# EAGLE design ntp-strat2 (EAGLE 7.6.0)
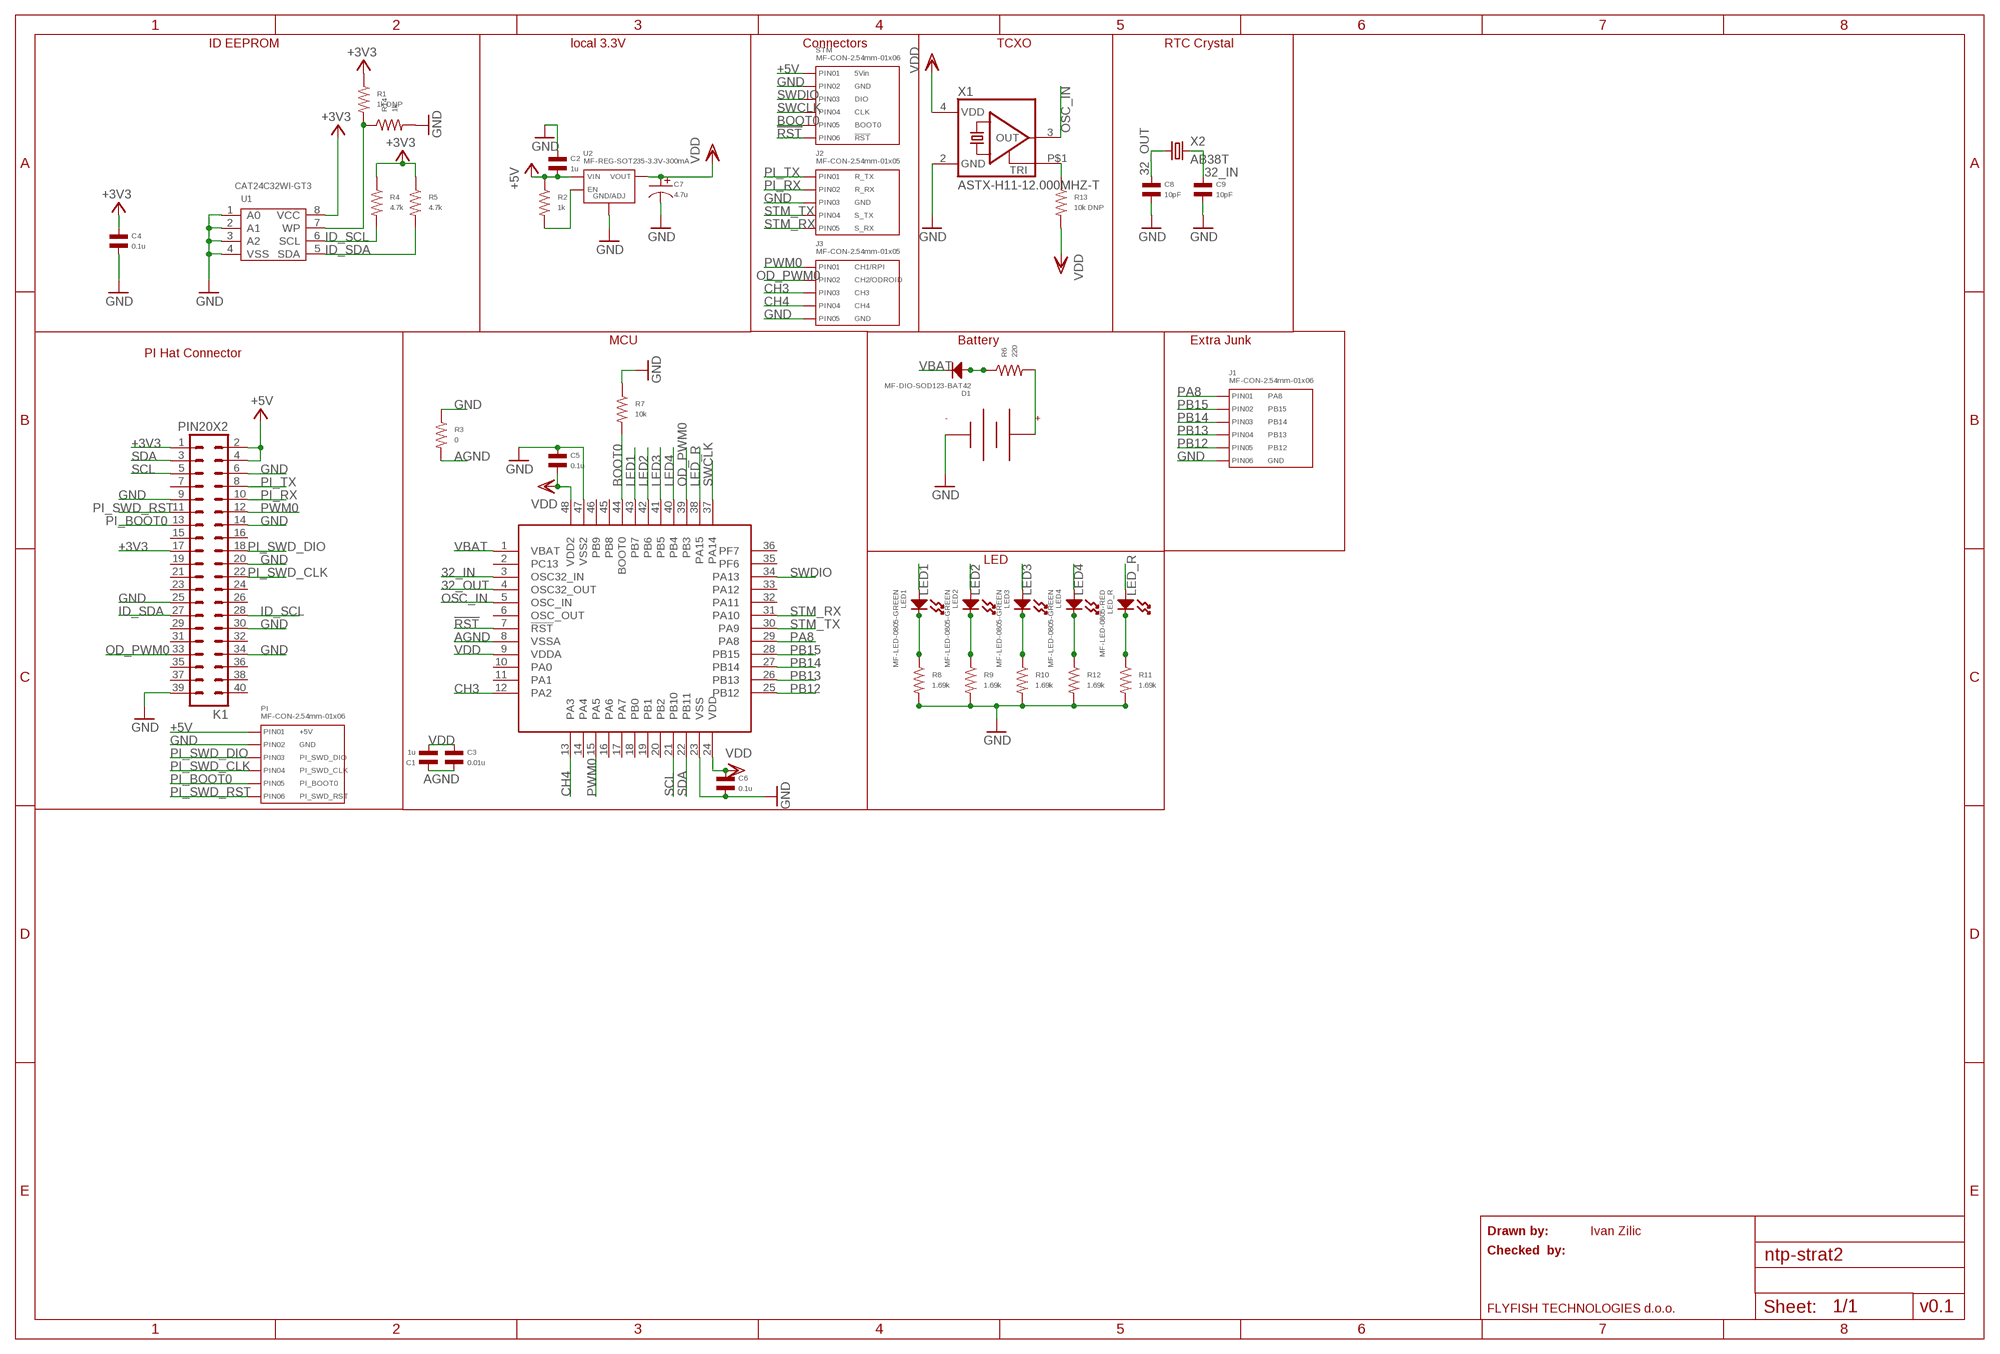
[diagram p0: schematic, sheet 1]

## Parts
C1  1u  CAPACITOR_NP_0603  [C0603]
C2  1u  CAPACITOR_NP_0603  [C0603]
C3  0.01u  CAPACITOR_NP_0603  [C0603]
C4  0.1u  CAPACITOR_NP_0603  [C0603]
C5  0.1u  CAPACITOR_NP_0603  [C0603]
C6  0.1u  CAPACITOR_NP_0603  [C0603]
C7  4.7u  CAPACITOR_P_4MM  [CP4MM]
C8  10pF  CAPACITOR_NP_0603  [C0603]
C9  10pF  CAPACITOR_NP_0603  [C0603]
D1  MF-DIO-SOD123-BAT42  DIODES_BAT42_SOD-123  [SOD-123]
J1  MF-CON-2.54mm-01x06  CON_01X06_PTH_2.54MM  [PTH_2.54MM_01X06]
J2  MF-CON-2.54mm-01x05  CON_01X05_PTH_2.54MM  [PTH_2.54MM_01X05]
J3  MF-CON-2.54mm-01x05  CON_01X05_PTH_2.54MM  [PTH_2.54MM_01X05]
K1  PIN20X2  [PIN_20X2]
LED1  MF-LED-0805-GREEN  LED_SINGLE-0805-GREEN  [LED0805]
LED2  MF-LED-0805-GREEN  LED_SINGLE-0805-GREEN  [LED0805]
LED3  MF-LED-0805-GREEN  LED_SINGLE-0805-GREEN  [LED0805]
LED4  MF-LED-0805-GREEN  LED_SINGLE-0805-GREEN  [LED0805]
LED_R  MF-LED-0805-RED  LED_SINGLE-0805-RED  [LED0805]
PI  MF-CON-2.54mm-01x06  CON_01X06_PTH_2.54MM  [PTH_2.54MM_01X06]
R1  1k DNP  RESISTOR_0603  [R0603]
R2  1k  RESISTOR_0603  [R0603]
R3  0  RESISTOR_0603  [R0603]
R4  4.7k  RESISTOR_0603  [R0603]
R5  4.7k  RESISTOR_0603  [R0603]
R6  220  RESISTOR_0603  [R0603]
R7  10k  RESISTOR_0603  [R0603]
R8  1.69k  RESISTOR_0603  [R0603]
R9  1.69k  RESISTOR_0603  [R0603]
R10  1.69k  RESISTOR_0603  [R0603]
R11  1.69k  RESISTOR_0603  [R0603]
R12  1.69k  RESISTOR_0603  [R0603]
R13  10k DNP  RESISTOR_0603  [R0603]
R14  1k  RESISTOR_0603  [R0603]
STM  MF-CON-2.54mm-01x06  CON_01X06_PTH_2.54MM  [PTH_2.54MM_01X06]
U1  CAT24C32WI-GT3  EEPROM-CAT24C256WI-GT3(SOIC8)  [SOIC8-1.27-5X4MM]
U2  MF-REG-SOT235-3.3V-300mA  TLV70233PDBVR  [SOT-23-5]
U3  STM32F031C6T6  STM32F031C  [LQFP48-7X7]
U4  BU2032SM-BT-GTR  BU2032SM  [BU2032SM]
X1  ASTX-H11-12.000MHZ-T  ASTX-H11  [ASVTX]
X2  AB38T  [AB38T]

## Nets
32_IN: C9.P$1 U3.3(OSC32_IN) X2.P2
32_OUT: C8.P$1 U3.4(OSC32_OUT) X2.P1
!RST: STM.P$6(PIN6) U3.7(!RST)
+3V3: C4.P$1 K1.1 K1.17 R1.P$1 R4.P$1 R5.P$1 U1.8(VCC)
+5V: C2.P$2 K1.2 K1.4 PI.P$1(PIN1) R2.P$1 STM.P$1(PIN1) U2.P$1(VIN)
AGND: C1.P$1 C3.P$2 R3.P$2 U3.8(VSSA)
BOOT0: R7.P$2 STM.P$5(PIN5) U3.44(BOOT0)
CH3: J3.P$3(PIN3) U3.12(PA2)
CH4: J3.P$4(PIN4) U3.13(PA3)
GND: C2.P$1 C4.P$2 C5.P$1 C6.P$2 C7.P$2 C8.P$2 C9.P$2 J1.P$6(PIN6) J2.P$3(PIN3) J3.P$5(PIN5) K1.6 K1.9 K1.14 K1.20 K1.25 K1.30 K1.34 K1.39 PI.P$2(PIN2) R3.P$1 R7.P$1 R8.P$2 R9.P$2 R10.P$2 R11.P$2 R12.P$2 R14.P$2 STM.P$2(PIN2) U1.1(A0) U1.2(A1) U1.3(A2) U1.4(VSS) U2.P$2(GND/ADJ) U3.23(VSS) U3.47(VSS2) U4.MINUS X1.2(GND)
ID_SCL: K1.28 R4.P$2 U1.6(SCL)
ID_SDA: K1.27 R5.P$2 U1.5(SDA)
LED1: LED1.ANODE U3.43(PB7)
LED2: LED2.ANODE U3.42(PB6)
LED3: LED3.ANODE U3.41(PB5)
LED4: LED4.ANODE U3.40(PB4)
LED_R: LED_R.ANODE U3.38(PA15)
N$1: R2.P$2 U2.P$3(EN)
N$2: LED1.CATHODE R8.P$1
N$3: R1.P$2 R14.P$1 U1.7(WP)
N$4: D1.ANODE R6.P$1
N$5: LED2.CATHODE R9.P$1
N$6: LED3.CATHODE R10.P$1
N$7: LED_R.CATHODE R11.P$1
N$8: LED4.CATHODE R12.P$1
N$9: R6.P$2 U4.PLUS
N$10: R13.P$1 X1.P$1(TRI)
OD_PWM0: J3.P$2(PIN2) K1.33 U3.39(PB3)
OSC_IN: U3.5(OSC_IN) X1.3(OUT)
PA8: J1.P$1(PIN1) U3.29(PA8)
PB12: J1.P$5(PIN5) U3.25(PB12)
PB13: J1.P$4(PIN4) U3.26(PB13)
PB14: J1.P$3(PIN3) U3.27(PB14)
PB15: J1.P$2(PIN2) U3.28(PB15)
PI_BOOT0: K1.13 PI.P$5(PIN5)
PI_RX: J2.P$2(PIN2) K1.10
PI_SWD_CLK: K1.22 PI.P$4(PIN4)
PI_SWD_DIO: K1.18 PI.P$3(PIN3)
PI_SWD_RST: K1.11 PI.P$6(PIN6)
PI_TX: J2.P$1(PIN1) K1.8
PWM0: J3.P$1(PIN1) K1.12 U3.15(PA5)
SCL: K1.5 U3.21(PB10)
SDA: K1.3 U3.22(PB11)
STM_RX: J2.P$5(PIN5) U3.31(PA10)
STM_TX: J2.P$4(PIN4) U3.30(PA9)
SWCLK: STM.P$4(PIN4) U3.37(PA14)
SWDIO: STM.P$3(PIN3) U3.34(PA13)
VBAT: D1.CATHODE U3.1(VBAT)
VDD: C1.P$2 C3.P$1 C5.P$2 C6.P$1 C7.P$1 R13.P$2 U2.P$5(VOUT) U3.9(VDDA) U3.24(VDD) U3.48(VDD2) X1.4(VDD)
Unconnected: K1.7 K1.15 K1.16 K1.19 K1.21 K1.23 K1.24 K1.26 K1.29 K1.31 K1.32 K1.35 K1.36 K1.37 K1.38 K1.40 U3.2(PC13) U3.6(OSC_OUT) U3.10(PA0) U3.11(PA1) U3.14(PA4) U3.16(PA6) U3.17(PA7) U3.18(PB0) U3.19(PB1) U3.20(PB2) U3.32(PA11) U3.33(PA12) U3.35(PF6) U3.36(PF7) U3.45(PB8) U3.46(PB9)

## Notes on the sheet
- ID EEPROM | local 3.3V | Connectors | TCXO | RTC Crystal
- MCU | Battery | Extra Junk
- PI Hat Connector
- LED
- Drawn by: | Ivan Zilic
- Checked  by:
- FLYFISH TECHNOLOGIES d.o.o. | v0.1

## Library data of the parts
C1-C6 C8 C9 = MF_Passives:CAPACITOR_NP: Library: MF_Passives Description: Device for Non-Polarized Capacitors. Manufacture part number (MPN) can be added via Attributes. Check https://factory.macrofab.com/parts for the house parts list.; POPULATE: 1
C7 = MF_Passives:CAPACITOR_P: Library: MF_Passives Description: Device for Polarized Capacitors. Manufacture part number (MPN), Voltage Rating, and Tolerance can be added via Attributes. Check https://factory.macrofab.com/parts for the house parts list.; HOUSEPART: MF-CAP-4MM-4.7uF; POPULATE: 1
D1 = MF_Discrete_Semiconductor:DIODES: Library: MF_Discrete_Semiconductor Description: Device for Single Packaged Diodes.; HOUSEPART: YES; MPN: MF-DIO-SOD123-BAT42; POPULATE: 1; URL: https://factory.macrofab.com/part/MF-DIO-SOD123-BAT42
J1 = MF_Connectors:CON_01X06: Library: MF_Connectors Description: Header Connector with 6 Positions and 01 Rows. Use the LABEL Attribute to label the pin on the schematic and PCB. You can remove the attributes on the PCB by using the SMASH function on the part and then deleting the text.; HOUSEPART: YES; LABEL01: PA8; LABEL02: PB15; LABEL03: PB14; LABEL04: PB13; LABEL05: PB12; LABEL06: GND; MPN: MF-CON-2.54mm-01x06; POPULATE: 1; URL: https://factory.macrofab.com/part/MF-CON-2.54mm-01x06
J2 = MF_Connectors:CON_01X05: Library: MF_Connectors Description: Header Connector with 5 Positions and 01 Rows. Use the LABEL Attribute to label the pin on the schematic and PCB. You can remove the attributes on the PCB by using the SMASH function on the part and then deleting the text.; HOUSEPART: YES; LABEL01: R_TX; LABEL02: R_RX; LABEL03: GND; LABEL04: S_TX; LABEL05: S_RX; MPN: MF-CON-2.54mm-01x05; POPULATE: 1; URL: https://factory.macrofab.com/part/MF-CON-2.54mm-01x05
J3 = MF_Connectors:CON_01X05: Library: MF_Connectors Description: Header Connector with 5 Positions and 01 Rows. Use the LABEL Attribute to label the pin on the schematic and PCB. You can remove the attributes on the PCB by using the SMASH function on the part and then deleting the text.; HOUSEPART: YES; LABEL01: CH1/RPI; LABEL02: CH2/ODROID; LABEL03: CH3; LABEL04: CH4; LABEL05: GND; MPN: MF-CON-2.54mm-01x05; POPULATE: 1; URL: https://factory.macrofab.com/part/MF-CON-2.54mm-01x05
K1 = FLYFISH:PIN20X2
LED1-LED4 = MF_LEDs:LED_SINGLE: Library: MF_LEDs Description: Device for Single LED Packages. Manufacture part number (MFG#) can be added via Attributes.; HOUSEPART: YES; MPN: MF-LED-0805-GREEN; POPULATE: 1; URL: https://factory.macrofab.com/part/MF-LED-0805-GREEN
LED_R = MF_LEDs:LED_SINGLE: Library: MF_LEDs Description: Device for Single LED Packages. Manufacture part number (MFG#) can be added via Attributes.; HOUSEPART: YES; MPN: MF-LED-0805-RED; POPULATE: 1; URL: https://factory.macrofab.com/part/MF-LED-0805-RED
PI = MF_Connectors:CON_01X06: Library: MF_Connectors Description: Header Connector with 6 Positions and 01 Rows. Use the LABEL Attribute to label the pin on the schematic and PCB. You can remove the attributes on the PCB by using the SMASH function on the part and then deleting the text.; HOUSEPART: YES; LABEL01: +5V; LABEL02: GND; LABEL03: PI_SWD_DIO; LABEL04: PI_SWD_CLK; LABEL05: PI_BOOT0; LABEL06: PI_SWD_RST; MPN: MF-CON-2.54mm-01x06; POPULATE: 1; URL: https://factory.macrofab.com/part/MF-CON-2.54mm-01x06
R1-R14 = MF_Passives:RESISTOR: Library: MF_Passives Description: Device for Resistors. Manufacture part number (MPN), Voltage, Tolerance, and Wattage Rating can be added via Attributes. Check https://factory.macrofab.com/parts for the house parts list.; POPULATE: 1
STM = MF_Connectors:CON_01X06: Library: MF_Connectors Description: Header Connector with 6 Positions and 01 Rows. Use the LABEL Attribute to label the pin on the schematic and PCB. You can remove the attributes on the PCB by using the SMASH function on the part and then deleting the text.; HOUSEPART: YES; LABEL01: 5Vin; LABEL02: GND; LABEL03: DIO; LABEL04: CLK; LABEL05: BOOT0; LABEL06: !RST; MPN: MF-CON-2.54mm-01x06; POPULATE: 1; URL: https://factory.macrofab.com/part/MF-CON-2.54mm-01x06
U1 = Seeed-OPL-ic:EEPROM-CAT24C256WI-GT3(SOIC8): 310090035; MPN: CAT24C256WI-GT3; VALUE: CAT24C256WI-GT3-SOIC8
U2 = MF_IC_Power:TLV702: Manufacturer Part #: TLV702 Manufacturer: Texas Instruments Description: LDO Voltage Regulators; HOUSEPART: YES; MPN: F-REG-SOT235-3.3V-300mA; POPULATE: 1; URL: https://factory.macrofab.com/part/MF-REG-SOT235-3.3V-300mA; VALUE: F-REG-SOT235-3.3V-300mA
U3 = STM32:STM32F031C
U4 = STM32:BU2032SM
X1 = crystal:ASTX-H11
X2 = crystal:AB38T

## Board
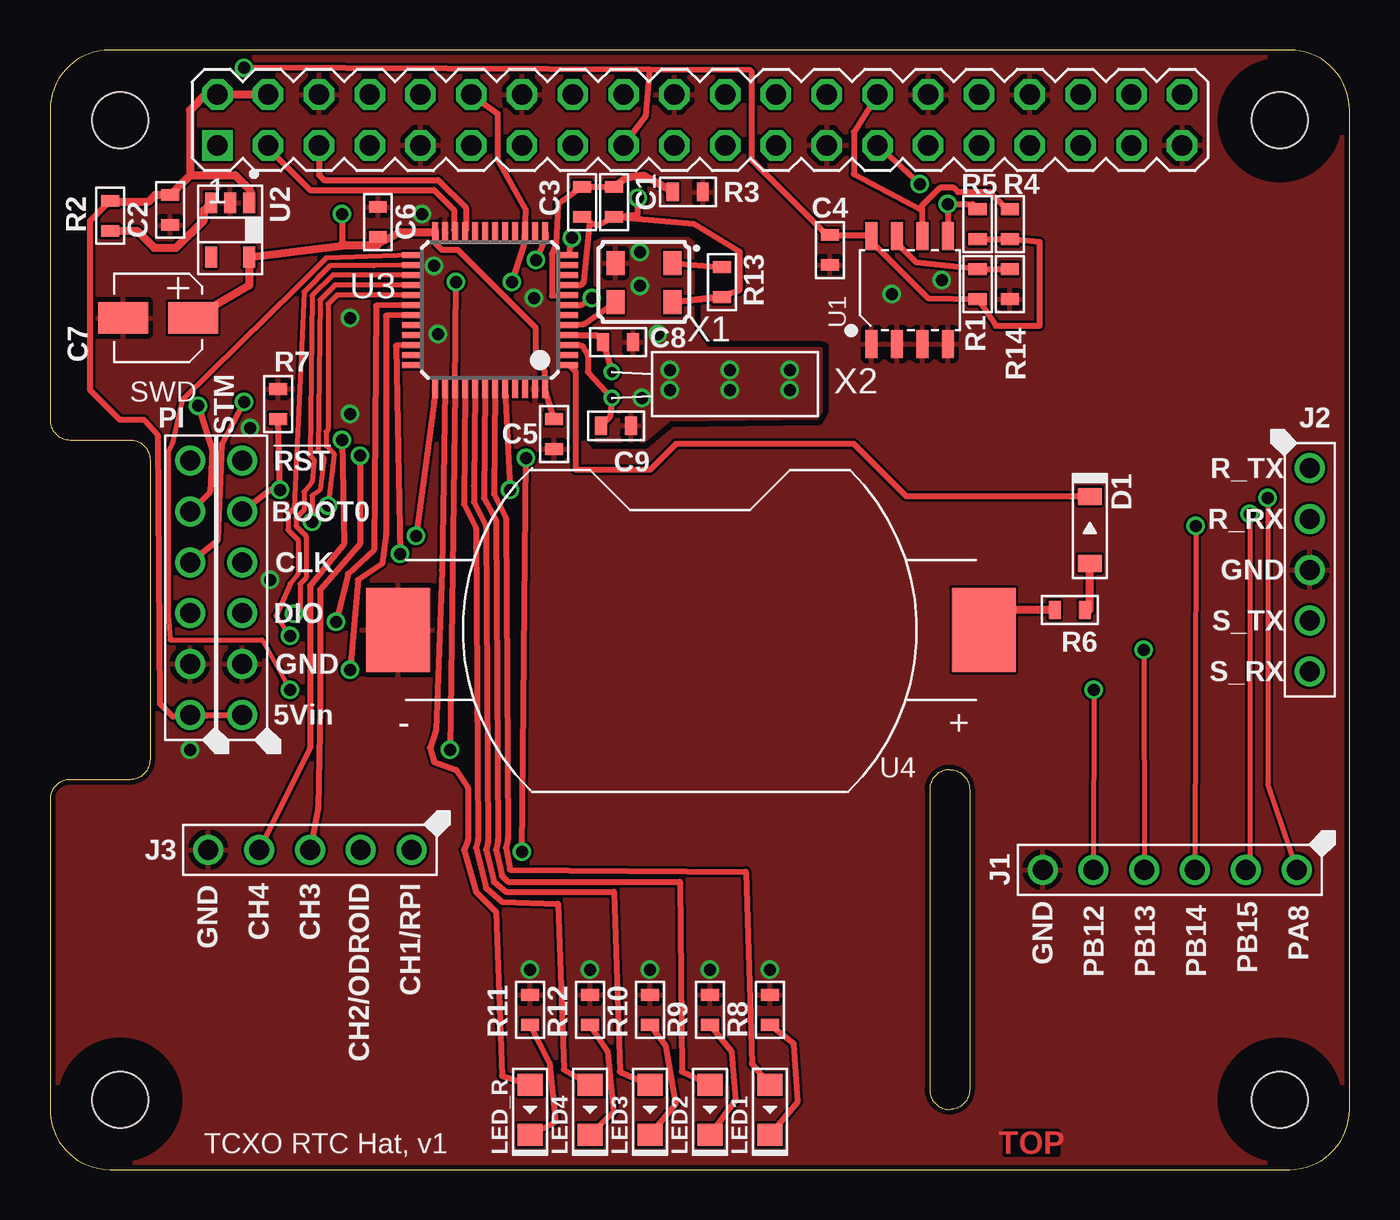
[diagram p1: board, top side]
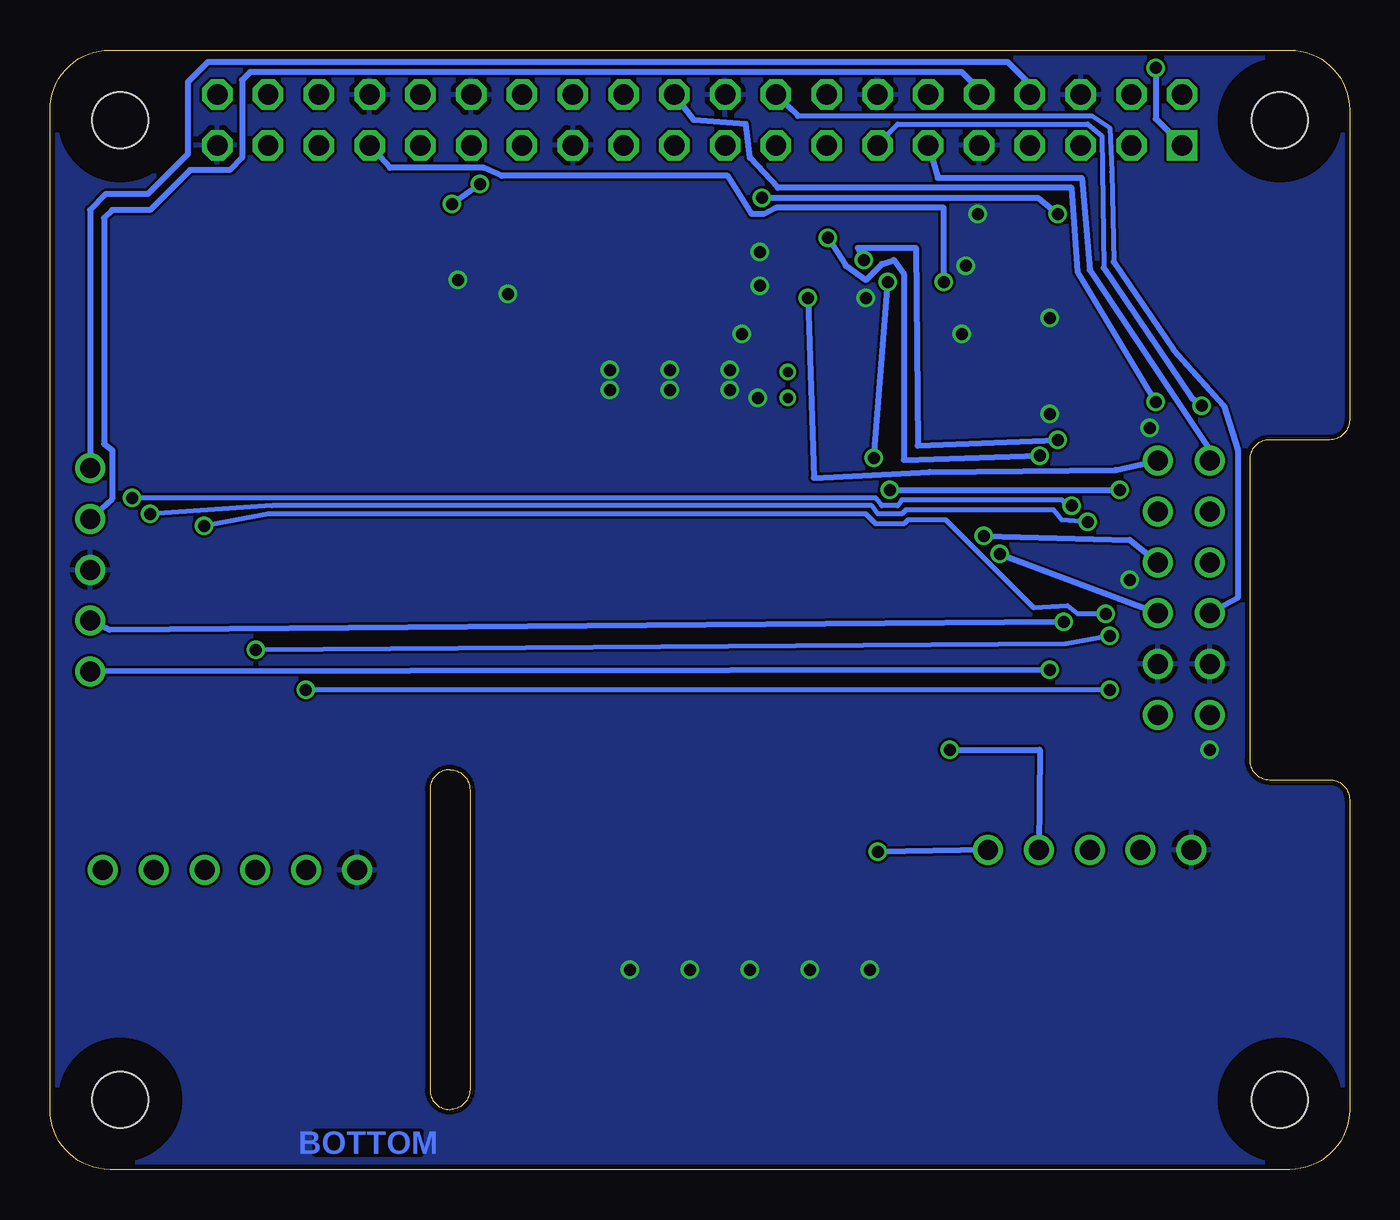
[diagram p2: board, bottom side, seen from below]

Size 65 x 56 mm. Coordinates in mm from the lower left corner, seen from the top.
Outline: 0,3 arc90 3,0 62,0 arc90 65,3 65,53 arc90 62,56 3,56 arc90 0,53 0,37.5 arc90 1,36.5 4,36.5 arc-90 5,35.5 5,20.5 arc-90 4,19.5 1,19.5 arc90 0,18.5 0,3
Outline: 44,19 44,4 arc90 45,3 arc90 46,4 46,19 arc90 45,20 arc90 44,19
Copper layers (1*16): Top 0.035mm / dielectric 1.5mm / Bottom 0.035mm
Design rules "MF_Standard_2_Layer": minimum track width 5mil, minimum drill 12mil, track to track 5mil, track to pad 5mil, pad to pad 5mil, via to via 5mil, smd to smd 0mil, copper to edge 10mil, drill to drill 10mil, minimum pad ring 6mil, minimum via ring 6mil, stop-mask expansion 2mil, vias tented up to drill 25mil, thermal gap 10mil
Holes 2.8 mm at 3.5,3.5 3.5,52.5 61.5,52.5 61.5,3.5
tRestrict: area 1.9,51 to 5,54; area 60,51 to 63,54; area 60,1.9 to 63,5; area 1.9,1.9 to 5,5; 16 lines
bRestrict: area 1.9,1.9 to 5,5; area 1.9,51 to 5,54; area 60,1.9 to 63,5; area 60,51 to 63,54
Milling: 6 lines

### Footprints (pad centres in the part's own frame; a part is rotated, then mirrored left to right if it is on the bottom)
C0603 = smd 0.6 x 0.9: P$1 -0.75,0; P$2 0.75,0
CP4MM = smd 1.6 x 2.5: P$1 0,-1.75; P$2 0,1.75
SOD-123 = smd 0.85 x 1.2: ANODE 1.675,0; CATHODE -1.675,0
PTH_2.54MM_01X06 = drill 1: P$1 -6.35,0; P$2 -3.81,0; P$3 -1.27,0; P$4 1.27,0; P$5 3.81,0; P$6 6.35,0
PTH_2.54MM_01X05 = drill 1: P$1 -5.08,0; P$2 -2.54,0; P$3 0,0; P$4 2.54,0; P$5 5.08,0
PIN_20X2 = drill 1.016 square: 1 -24.13,-1.27 | drill 1.016 octagon: 2 -24.13,1.27; 3 -21.59,-1.27; 4 -21.59,1.27; 5 -19.05,-1.27; 6 -19.05,1.27; 7 -16.51,-1.27; 8 -16.51,1.27; 9 -13.97,-1.27; 10 -13.97,1.27; 11 -11.43,-1.27; 12 -11.43,1.27; 13 -8.89,-1.27; 14 -8.89,1.27; 15 -6.35,-1.27; 16 -6.35,1.27; 17 -3.81,-1.27; 18 -3.81,1.27; 19 -1.27,-1.27; 20 -1.27,1.27; 21 1.27,-1.27; 22 1.27,1.27; 23 3.81,-1.27; 24 3.81,1.27; 25 6.35,-1.27; 26 6.35,1.27; 27 8.89,-1.27; 28 8.89,1.27; 29 11.43,-1.27; 30 11.43,1.27; 31 13.97,-1.27; 32 13.97,1.27; 33 16.51,-1.27; 34 16.51,1.27; 35 19.05,-1.27; 36 19.05,1.27; 37 21.59,-1.27; 38 21.59,1.27; 39 24.13,-1.27; 40 24.13,1.27
LED0805 = smd 1.1 x 1.25: ANODE 1.25,0; CATHODE -1.25,0
R0603 = smd 0.6 x 0.9: P$1 -0.75,0; P$2 0.75,0
SOIC8-1.27-5X4MM = smd 0.6 x 1.4: 1 -1.905,-2.7; 2 -0.635,-2.7; 3 0.635,-2.7; 4 1.905,-2.7; 5 1.905,2.7; 6 0.635,2.7; 7 -0.635,2.7; 8 -1.905,2.7
SOT-23-5 = smd 1.05 x 0.6: P$1 -1.35,0.95; P$2 -1.35,0; P$3 -1.35,-0.95; P$4 1.35,-0.95; P$5 1.35,0.95
LQFP48-7X7 = smd 0.9 x 0.3: 1 -3.95,2.75; 2 -3.95,2.25; 3 -3.95,1.75; 4 -3.95,1.25; 5 -3.95,0.75; 6 -3.95,0.25; 7 -3.95,-0.25; 8 -3.95,-0.75; 9 -3.95,-1.25; 10 -3.95,-1.75; 11 -3.95,-2.25; 12 -3.95,-2.75; 25 3.95,-2.75; 26 3.95,-2.25; 27 3.95,-1.75; 28 3.95,-1.25; 29 3.95,-0.75; 30 3.95,-0.25; 31 3.95,0.25; 32 3.95,0.75; 33 3.95,1.25; 34 3.95,1.75; 35 3.95,2.25; 36 3.95,2.75 | smd 0.3 x 0.9: 13 -2.75,-3.95; 14 -2.25,-3.95; 15 -1.75,-3.95; 16 -1.25,-3.95; 17 -0.75,-3.95; 18 -0.25,-3.95; 19 0.25,-3.95; 20 0.75,-3.95; 21 1.25,-3.95; 22 1.75,-3.95; 23 2.25,-3.95; 24 2.75,-3.95; 37 2.75,3.95; 38 2.25,3.95; 39 1.75,3.95; 40 1.25,3.95; 41 0.75,3.95; 42 0.25,3.95; 43 -0.25,3.95; 44 -0.75,3.95; 45 -1.25,3.95; 46 -1.75,3.95; 47 -2.25,3.95; 48 -2.75,3.95
BU2032SM = smd 3.2 x 4.2: MINUS 14.6,0; PLUS -14.7,0
ASVTX = smd 0.9 x 1.2: 2 0.925,-1.45; 3 0.925,0.5; 4 -1.925,0.5; P$1 -1.925,-1.45
AB38T = drill 0.5: P1 -0.6,0; P2 0.7,0

### Placement (x,y rotation side)
C1  28.2,48.4 270 top
C2  6,48 90 top
C3  26.6,48.4 90 top
C4  39,46 270 top
C5  25.2,36.8 90 top
C6  16.4,47.4 90 top
C7  5.4,42.6 90 top
C8  28.4,41.4 0 top
C9  28.3,37.2 0 top
D1  52,32 270 top
J1  56,15 180 top
J2  63,30 270 top
J3  13,16 180 top
K1  32.5,52.5 0 top
LED1  36,3 90 top
LED2  33,3 90 top
LED3  30,3 90 top
LED4  27,3 90 top
LED_R  24,3 90 top
PI  7,29.1 90 top
R1  46.4,44.3 90 top
R2  3,47.7 270 top
R3  31.9,48.9 180 top
R4  48,47.3 90 top
R5  46.4,47.3 90 top
R6  51,28 180 top
R7  11.4,38.3 270 top
R8  36,8 90 top
R9  33,8 90 top
R10  30,8 90 top
R11  24,8 90 top
R12  27,8 90 top
R13  33.6,44.4 270 top
R14  48,44.3 270 top
STM  9.6,29.1 90 top
U1  43,44 0 top
U2  9,47 270 top
U3  22,43 180 top
U4  32,27 180 top
X1  29.2,43.9 180 top
X2  28.1,39.3 270 top

### Tracks (layer width: path | path; a pad name or v marks a point on that pad's centre or on a via)
32_IN
  Top 0.305: U3.3 26.45,41.25 26.6,41.2 26.9,40.7 26.9,39.9 X2.P2 28,37.65 C9.P$1
32_OUT
  Top 0.305: X2.P1 C8.P$1 27.3,41.75 U3.4
!RST  (via drill 0.6)
  Top 0.305: U3.7 26.55,43.25 v27.1,43.6
  Bottom 0.305: v27.1,43.6 26.8,34.6 21,34.9 11.7,35 STM.P$6
+3V3  (via drill 0.6)
  Top 0.305: 30,55.02 35,55 35.1,54.9 35.1,50.5 38.85,46.75 C4.P$1 39.05,46.7 U1.8 41.09,46.41 43.9,43.6 R1.P$1 47.3,42.2 49.5,42.2 49.5,46.4 R4.P$1 R5.P$1 | 30,55.02 v9.7,55.1 | K1.17 29.8,52.7 30,55.02
  Bottom 0.305: v9.7,55.1 9.7,52.56 K1.1
+5V
  Top 0.305: R2.P$1 2,47.45 2,39 3.5,37.5 4.7,37.5 5.4,36.7 5.5,23.3 6.15,22.65 STM.P$1 PI.P$1
  Top 0.406: K1.2 K1.4 7.77,53.77 7,53 7,49.75 | 7,49.75 C2.P$2 5.25,48.75 4.9,48.4 3.05,48.4 R2.P$1 | 7,49.75 9.25,49.75 10,49 10,48.4 U2.P$1
AGND
  Top 0.305: C1.P$1 C3.P$2 | C3.P$2 26.75,49.25 | C3.P$2 25.4,48.3 25.3,46.3 25.1,45.8 25.1,43.7 U3.8
  Top 0.406: R3.P$2 31,48.9 31,49 29.7,49.7 28.8,49.6 C1.P$1
BOOT0  (via drill 0.6)
  Top 0.305: STM.P$5 11,34 v11.5,34 R7.P$2 | U3.44 v23,34
  Bottom 0.305: v23,34 v11.5,34
CH3  (via drill 0.6)
  Top 0.305: U3.12 v26.1,46.6 | v15.5,35.7 15.5,31.3 13.5,29 13.5,23.2 13.4,18.1 J3.P$3
  Bottom 0.305: v26.1,46.6 25.2,45.2 24.2,44.5 23.4,45.3 22.8,45.5 22.3,44.8 22.3,35.5 v15.5,35.7
CH4  (via drill 0.6)
  Top 0.305: v14.6,36.5 14.7,31.3 13,29.2 13,21.1 J3.P$4 | U3.13 24.8,46.6 v24.3,45.5
  Bottom 0.305: v24.3,45.5 24.6,46.1 21.7,46.1 21.6,36.2 v14.6,36.5
GND  (via drill 0.6, 0.6 pad 0.25)
  other vias: 29.5,45.9 29.5,44.2 31,40 31,39 34,40 34,39 37,39 37,40 30.4,41.8 29.6,38.6 42.1,43.8 44.6,44.5 24,10 27,10 30,10 33,10 36,10 24.2,43.6 19.2,45.2 19.4,41.8 18.6,47.8 11,29.5 15,42.6 15,37.8 10,37.1 7,21
  pour Bottom: 0,3 arc90 3,0 62,0 arc90 65,3 65,53 arc90 62,56 3,56 arc90 0,53 0,37.5 arc90 1,36.5 4,36.5 arc-90 5,35.5 5,20.5 arc-90 4,19.5 1,19.5 arc90 0,18.5
  pour Top (rank 2): 0,3 arc90 3,0 62,0 arc90 65,3 65,53 arc90 62,56 3,56 arc90 0,53 0,37.5 arc90 1,36.5 4,36.5 arc-90 5,35.5 5,20.5 arc-90 4,19.5 1,19.5 arc90 0,18.5
ID_SCL
  Top 0.305: 43.6,48 43.6,48.2 44.5,49.1 45.2,49.1 45.4,48.9 47,48.9 47.85,48.05 R4.P$2 | 43.6,48 43.6,46.73 U1.6 | K1.28 40.2,51.9 40.2,49.8 43.6,48
ID_SDA  (via drill 0.6)
  Top 0.305: U1.5 v44.9,48.3 46.15,48.3 R5.P$2 | K1.27 v43.5,49.3
  Bottom 0.305: v43.5,49.3 v44.9,48.3
LED1
  Top 0.305: U3.43 22.2,33.8 22.8,32.6 22.9,16.6 22.8,16.1 23,15 34.8,14.9 35.1,5.3 LED1.ANODE
LED2
  Top 0.305: U3.42 21.7,33.6 22.3,32.5 22.4,16.5 22.3,16 22.6,14.7 22.9,14.4 31.5,14.4 31.6,4.9 LED2.ANODE
LED3
  Top 0.305: U3.41 21.2,34.2 21.2,33.4 21.8,32.2 21.9,16.4 21.8,16 22.2,14.4 22.8,13.9 28.2,13.9 28.5,4.9 LED3.ANODE
LED4
  Top 0.305: U3.40 20.7,33.3 21.3,32.1 21.4,16.5 21.3,16.1 21.8,14.1 22.6,13.4 25.4,13.3 25.7,5 LED4.ANODE
LED_R
  Top 0.305: U3.38 19.6,30 19.3,22 19,21.1 19.2,20.4 20.3,20 20.9,19.1 20.9,16.5 20.7,16 21.3,13.9 22.3,12.9 22.6,4.7 LED_R.ANODE
N$1
  Top 0.406: R2.P$2 4.35,46.95 5.2,46.1 6.3,46.1 7.7,47.5 7.7,48 U2.P$3
N$2
  Top 0.305: LED1.CATHODE 37.4,3.4 37.2,6.3 R8.P$1
N$3
  Top 0.305: U1.7 42.37,46.34 43.3,45.4 46.15,45.1 R1.P$2 R14.P$1
N$4
  Top 0.406: R6.P$1 52,28 D1.ANODE
N$5
  Top 0.305: LED2.CATHODE 34.3,3.5 34.1,5.9 R9.P$1
N$6
  Top 0.305: LED3.CATHODE 31.3,3.3 30.8,6.2 R10.P$1
N$7
  Top 0.305: LED_R.CATHODE 25.3,2.4 25,5.3 R11.P$1
N$8
  Top 0.305: LED4.CATHODE 28.2,2.9 27.9,5.9 R12.P$1
N$9
  Top 0.406: R6.P$2 46.7,28 U4.PLUS
N$10
  Top 0.305: X1.P$1 R13.P$1
OD_PWM0  (via drill 0.6)
  Top 0.305: v20.3,44.4 U3.39 v20,21
  Bottom 0.305: v20.3,44.4 20.3,48.1 28.7,48.1 29.3,47.8 29.9,47.8 31.1,49.7 42.4,49.7 43.3,50.1 48,50.1 K1.33 | v20,21 15.5,21 J3.P$2
OSC_IN
  Top 0.305: U3.5 26.7,42.3 X1.3
PA8  (via drill 0.6 pad 0.25)
  Top 0.254: U3.29 14.35,43.75 13.9,43.3 13.9,37 13.8,36.9 13.8,36.2 14.2,35.8 v13.9,33.2 | v60.9,33.6 60.9,19.25 J1.P$1
  Bottom 0.254: v60.9,33.6 23.7,33.6 23.4,33.2 22.6,33.2 22.4,33.5 14.4,33.5 14.1,33.2 v13.9,33.2
PB12  (via drill 0.6 pad 0.25)
  Top 0.254: U3.25 13.8,45.6 12.3,44.1 6.6,38.5 6.1,36.3 5.9,35.9 5.9,27.8 6,26.5 10.6,26.5 v12,24 | v52.2,24 J1.P$5
  Bottom 0.254: v12,24 v52.2,24
PB13  (via drill 0.6 pad 0.25)
  Top 0.254: U3.26 16.2,45.2 14,45.2 12.7,43.9 12.2,33.1 11.9,32.8 11.9,32 12.4,31.5 12.4,29.8 12,29.3 11.3,27.7 v12,26.7 | v54.7,26 J1.P$4
  Bottom 0.254: v12,26.7 14.2,26.3 v54.7,26
PB14  (via drill 0.6 pad 0.25)
  Top 0.254: U3.27 14.15,44.75 13.1,43.7 13,35.7 13.2,35.5 13.1,34.4 12.7,33.9 12.7,33 12.3,32.6 12.3,32.2 12.8,31.7 12.8,29.6 12.5,29.3 12.5,28 v12.2,27.8 | v57.3,32.2 J1.P$3
  Bottom 0.254: v12.2,27.8 13.6,27.8 14.1,28.2 15.8,28.1 20.2,32.5 22.1,32.5 22.3,32.3 23.7,32.3 24.2,32.8 54.1,32.8 v57.3,32.2
PB15  (via drill 0.6 pad 0.25)
  Top 0.254: U3.28 14.25,44.25 13.5,43.5 13.4,36 13.7,35.6 13.5,34 13.1,33.7 v13.1,32.4 | v60,32.8 60,15.19 J1.P$2
  Bottom 0.254: v13.1,32.4 14.4,32.5 14.8,33 22.2,33 22.4,32.8 23.6,32.8 23.9,33.2 53.9,33.2 v60,32.8
PI_BOOT0  (via drill 0.6)
  Top 0.305: v7.4,38.2 8.1,36 8,33.9 PI.P$5
  Bottom 0.254: K1.13 22.6,52.3 13.1,52.3 12.4,51.7 12.3,45.1
  Bottom 0.305: 12.3,45.1 7.9,38.6 v7.4,38.2
PI_RX
  Bottom 0.305: K1.10 18.53,54.03 19.4,54.9 55,54.9 55.4,54.5 55.4,50.6 56,50 58,50 60,48 61.9,48 62.3,47.6 62.3,36.3 61.9,36 61.9,33.54 J2.P$2
PI_SWD_CLK  (via drill 0.6)
  Top 0.305: PI.P$4 8.4,31.5 8.6,36.3 v9.7,38.4
  Bottom 0.305: v9.7,38.4 13.6,44.9 13.9,49.1 28.6,49.1 30,50.6 30.2,52.3 32.8,52.5 K1.22
PI_SWD_DIO
  Bottom 0.254: 27.6,52.7 12.9,52.7 12,52.1 11.9,49.9 11.8,45.4
  Bottom 0.305: K1.18 27.6,52.7 | 11.8,45.4 8.8,41 6.3,38.2 5.6,36 5.6,28.6 PI.P$3
PI_SWD_RST
  Bottom 0.305: K1.11 20.6,49.6 13.4,49.6 13,45 7,36 PI.P$6
PI_TX
  Bottom 0.305: K1.8 15.99,54.29 17.1,55.4 57.1,55.4 58.1,54.4 58.1,50.8 60.1,48.8 62.2,48.8 63,48 J2.P$1
PWM0  (via drill 0.6)
  Top 0.305: K1.12 22.4,52.8 22.4,50.5 23.8,48 U3.15 23.7,46.2 v23.1,44.4 | v23.6,15.9 v23.8,35.6
  Bottom 0.305: J3.P$1 v23.6,15.9 | v23.8,35.6 v23.1,44.4
SCL
  Top 0.305: K1.5 13.45,49.75 13.7,49.5 19.4,49.5 20.8,48.1 20.8,47 U3.21
SDA
  Top 0.305: K1.3 10.91,51.09 13,49 19.2,49 20.2,48 20.2,47 U3.22
STM_RX  (via drill 0.6)
  Top 0.305: U3.31 16.8,42.7 16.8,31.8 16.6,30.3 15.4,29.5 v15,25
  Bottom 0.305: v15,25 J2.P$5
STM_TX  (via drill 0.6)
  Top 0.305: U3.30 16.3,43.2 16.2,31 14.9,29.8 v14.3,27.4
  Bottom 0.305: v14.3,27.4 62,27 J2.P$4
SWCLK  (via drill 0.6)
  Top 0.305: U3.37 19.2,38.4 v18.3,31.7
  Bottom 0.305: v18.3,31.7 11,31.5 STM.P$4
SWDIO  (via drill 0.6)
  Top 0.305: U3.34 17.3,41.2 v17.5,30.8
  Bottom 0.305: v17.5,30.8 STM.P$3
VBAT
  Top 0.305: D1.CATHODE 42.83,33.67 40.2,36.3 31.3,36.3 30,35 26.3,35 26.3,39.9 U3.1 26,40.2
VDD  (via drill 0.6)
  Top 0.305: R13.P$2 X1.4 33.6,43.7 34.5,44 34.5,45.9 32.2,47.3 C1.P$2 | 27,47.35 26.7,44.4 26.55,44.25 U3.9 25.65,44.25 | 27,47.35 C3.P$1 | 27,47.35 27.4,47.25 C1.P$2 | U3.24 19.3,46.9 19.3,46.3 19.6,46 20.4,46 24.3,42.1 24.3,40.4 24.75,39.95 U3.48 C5.P$2 | v29.4,48.6 29.4,47.8 C1.P$2 | v14.6,47.8 14.6,46.4 14.8,46.25
  Top 0.406: C7.P$1 9.95,44.2 U2.P$5 14.8,46.25 16.25,46.25 | 16.25,46.25 17.5,46.9 19.2,46.9 U3.24 | 16.25,46.25 16.4,46.25 C6.P$1
  Bottom 0.305: v29.4,48.6 15.6,48.6 v14.6,47.8

### Text on the board
Top: TOP
Bottom: BOTTOM
tNames: SWD | U4 | TCXO RTC Hat, v1